# Altium schematic sheet RF_STM.SchDoc
size A4
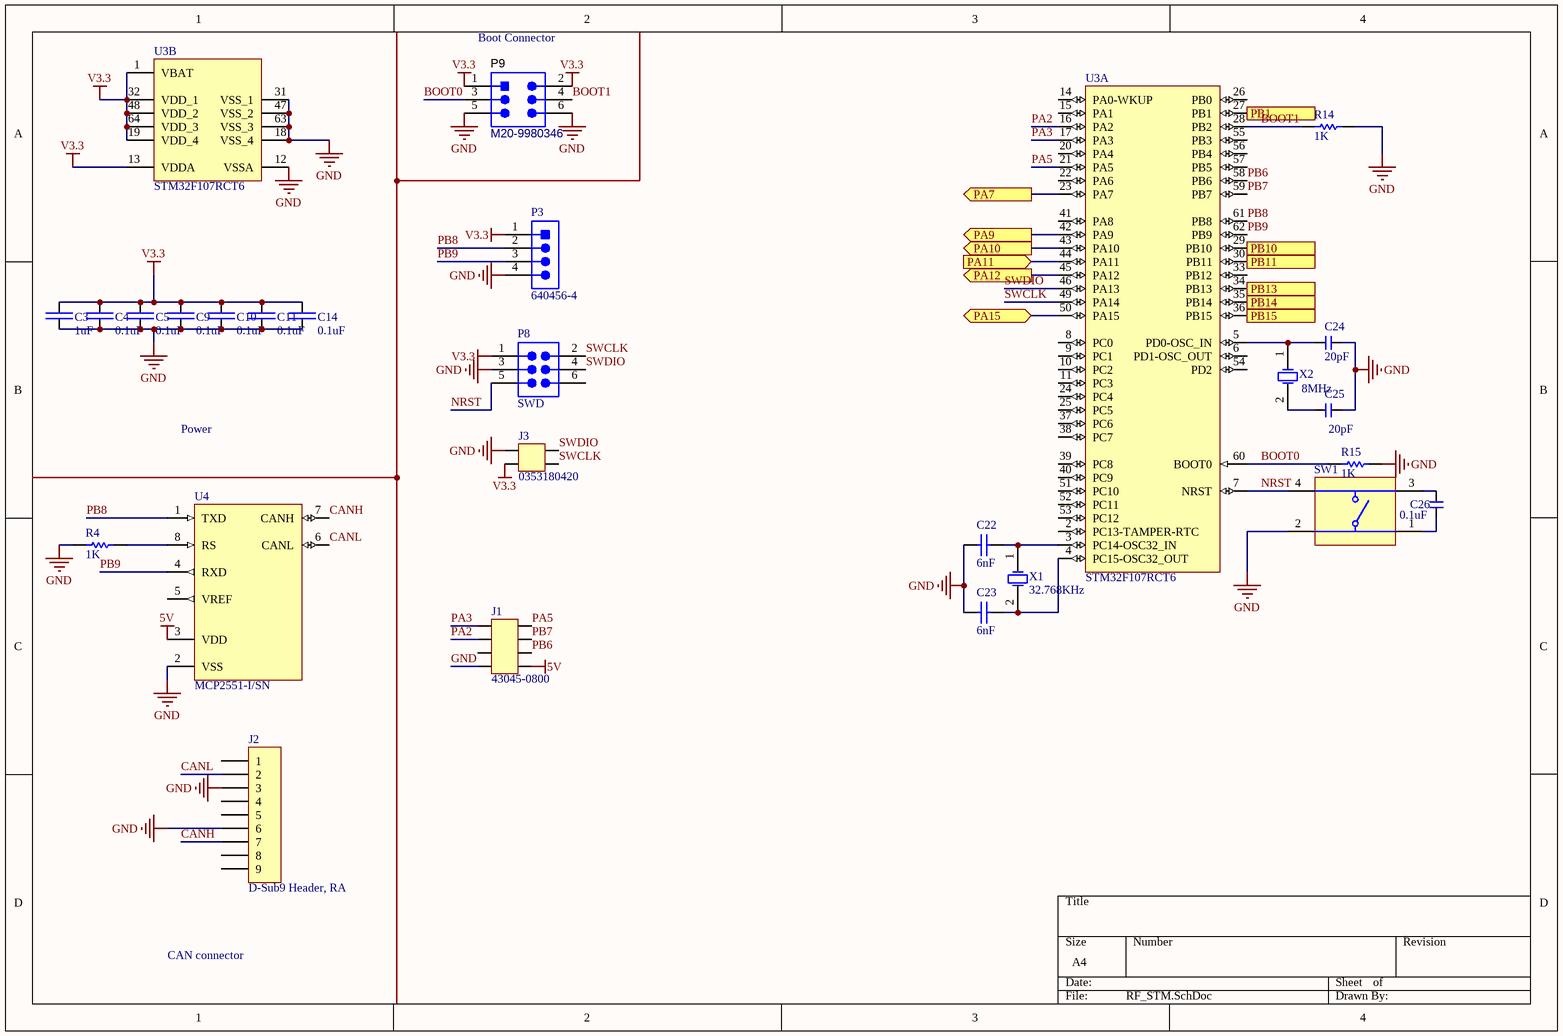
[diagram p0: RF_STM.SchDoc]

## Parts
C3  1uF  [C0805]
C4  0.1uF  [C0805]
C5  0.1uF  [C0805]
C9  0.1uF  [C0805]
C10  0.1uF  [C0805]
C11  0.1uF  [C0805]
C14  0.1uF  [C0805]
C22  6nF  [CAPC2013X140X50LL20T25]
C23  6nF  [CAPC2013X140X50LL20T25]
C24  20pF  [C0805]
C25  20pF  [C0805]
C26  0.1uF  [C0805]
J1  43045-0800  [Micro-Fit 3.0 8pos]
J2  D-Sub9 Header, RA  [D9 Connector]
J3  0353180420  [Mini-fit Jr. 4pos]
P3  640456-4  [TECO-640456-4]
P8  SWD  [SMTC-TSW-103-08-X-D]
P9  M20-9980346  [HRWN-M20-9980346_V]
R4  1K  [RESC1608X55X25ML10T15]
R14  1K  [RESC2013X50X30NL20T20]
R15  1K  [RESC2013X50X30NL20T20]
SW1  PTS645SM43SMTR92LFS  [ITT-PTS645S-4_V]  (value not drawn)
U3  STM32F107RCT6  [STM-LQFP64_M]  (parts A,B of 2)
U4  MCP2551-I/SN  [SOIC-SN8_N]
X1  32.768KHz  [ABRA-ABS07-2_V]
X2  8MHz  [ABRA-ABM3-2_V]

## Ports
PA7 (out), PA9 (out), PA10 (out), PA11 (in), PA12 (out), PA15 (bidir), PB1 (out), PB10 (out), PB11 (in), PB13 (out), PB14 (out), PB15 (out)

## Nets
5V: J1.4 U4.3(VDD)
GND: C3.2 C4.1 C5.1 C9.1 C10.2 C11.1 C14.1 C22.1 C23.1 C24.1 C25.1 J1.8 J2.3 J2.6 J3.1 P3.4 P8.3 P9.5 P9.6 R4.1 R14.1 R15.1 SW1.2 U3.12(VSSA) U3.18(VSS_4) U3.31(VSS_1) U3.47(VSS_2) U3.63(VSS_3) U4.2(VSS)
V3.3: C3.1 C4.2 C5.2 C9.2 C10.1 C11.2 C14.2 J3.3 P3.1 P8.1 P9.1 P9.2 U3.1(VBAT) U3.13(VDDA) U3.19(VDD_4) U3.32(VDD_1) U3.48(VDD_2) U3.64(VDD_3)
BOOT0: P9.3 R15.2 U3.60(BOOT0)
BOOT1: P9.4 R14.2 U3.28(PB2)
CANH: J2.7 U4.7(CANH)
CANL: J2.2 U4.6(CANL)
NRST: P8.5 SW1.4 U3.7(NRST)
PA2: J1.6 U3.16(PA2)
PA3: J1.5 U3.17(PA3)
PA5: J1.1 U3.21(PA5)
PA7: U3.23(PA7) ; port PA7
PA9: U3.42(PA9) ; port PA9
PA10: U3.43(PA10) ; port PA10
PA11: U3.44(PA11) ; port PA11
PA12: U3.45(PA12) ; port PA12
PA15: U3.50(PA15) ; port PA15
PB1: U3.27(PB1) ; port PB1
PB6: J1.3 U3.58(PB6)
PB7: J1.2 U3.59(PB7)
PB8: P3.2 U3.61(PB8) U4.1(TXD)
PB9: P3.3 U3.62(PB9) U4.4(RXD)
PB10: U3.29(PB10) ; port PB10
PB11: U3.30(PB11) ; port PB11
PB13: U3.34(PB13) ; port PB13
PB14: U3.35(PB14) ; port PB14
PB15: U3.36(PB15) ; port PB15
SWCLK: J3.4 P8.2 U3.49(PA14)
SWDIO: J3.2 P8.4 U3.46(PA13)
NetC22_2: C22.2 U3.3(PC14-OSC32_IN) X1.1(X1)
NetC23_2: C23.2 U3.4(PC15-OSC32_OUT) X1.2(X2)
NetC24_2: C24.2 U3.5(PD0-OSC_IN) X2.1(X1)
NetC25_2: C25.2 X2.2(X2)
NetC26_1: C26.1 SW1.3
NetC26_2: C26.2 SW1.1
NetR4_2: R4.2 U4.8(RS)

Not connected (* = marked no-connect by the designer): J1 7; J2 1 4 5 8 9; P8 6; U3 2(PC13-TAMPER-RTC) 6(PD1-OSC_OUT) 8(PC0) 9(PC1) 10(PC2) 11(PC3) 14(PA0-WKUP) 15(PA1) 20(PA4) 22(PA6) 24(PC4) 25(PC5) 26(PB0) 33(PB12) 37(PC6) 38(PC7) 39(PC8) 40(PC9) 41(PA8) 51(PC10) 52(PC11) 53(PC12) 54(PD2) 55(PB3) 56(PB4) 57(PB5); U4 5(VREF)

## Notes on the sheet
- (near P9) Boot Connector
- Power
- CAN connector

## Library data of the parts
C3 = CL21B105KAFNNNE: Cap Ceramic 1uF 25V X7R 10% SMD 0805 125C T/R; Manufacturer: Samsung; Supplier 1: Digi-Key; Supplier Part Number 1: 1276-1066-1-ND; Manufacturer Part Number: CL21B105KAFNNNE; Stock 1: 1606570; Pricing 1: 1 = 0.10000, 10 = 0.07600, 100 = 0.03380, 500 = 0.02416, 1000 = 0.01898 (USD); RoHS: Yes; Mount: Surface Mount; Case/Package: 0805; Contact Plating: Tin; Case Code (Metric): 2012; Case Code (Imperial): 0805; Min Operating Temperature: -55°C; Max Operating Temperature: 125°C; Packaging: Tape and Reel; Package Quantity: 1; Capacitance: 1uF; Tolerance: 10%; Voltage Rating: 25V; Dielectric: X7R; Voltage: 25V; Voltage Rating (DC): 25V; Length: 2mm; Height: 1.25mm; Depth: 1.25mm; Width: 0.049inch; Thickness: 0.053inch; Radiation Hardening: No; Lead Free: Lead Free; ComponentLink1URL: https://datasheet.ciiva.com/25800/cl21b105kafnnne-25800163.pdf?src-supplier=Digi-Key; ComponentLink1Description: https://datasheet.ciiva.com/25800/cl21b105kafnnne-25800163.pdf?src-supplier=Digi-Key; ComponentLink2URL: https://datasheet.ciiva.com/15195/getdatasheetpartid-355205-15195880.pdf?src-supplier=Verical; ComponentLink2Description: https://datasheet.ciiva.com/15195/getdatasheetpartid-355205-15195880.pdf?src-supplier=Verical; Category: Capacitors
C4 C5 C9-C11 C14 C26 = CL21B104KBCWPNC: CAP CER 0.1UF 50V X7R 0805; Manufacturer: Samsung; Capacitance: 100nF; Tolerance: 10%; Supplier 1: Digi-Key; Supplier Part Number 1: 1276-6557-1-ND; Manufacturer Part Number: CL21B104KBCWPNC; Stock 1: 6545; Pricing 1: 1 = 0.10000, 10 = 0.06700, 100 = 0.02990, 500 = 0.02138, 1000 = 0.01680 (USD); RoHS: Yes; Mount: Surface Mount; Case/Package: 0805; Case Code (Metric): 2012; Case Code (Imperial): 0805; Min Operating Temperature: -55°C; Max Operating Temperature: 125°C; Packaging: Tape and Reel; Voltage Rating: 50V; Features: Soft Termination; Length: 0.079inch; Width: 0.049inch; Thickness: 0.053inch; Ratings: AEC-Q200; Category: Capacitors
C22 C23 = CMP-2000-05810-1: Chip Capacitor, 2.2 uF, +/- 10%, 10 V, -55 to 85 degC, 0805 (2012 Metric), RoHS, Tape and Reel; Manufacturer: AVX; Dielectric: X5R; Rated Voltage: 10V; Capacitance: 2.2µF; Tolerance (%): ±10%; Datasheet Version: 05/2016; Manufacturer URL: http://www.avx.com/; Package Description: 2-Pin Surface Mount Device, Body 2.01 x 1.25 mm; Mounting Technology: SurfaceMount; Case Size/Dimension: 0805; Package Reference: 0805; Datasheet URL: http://datasheets.avx.com/cx5r.pdf
C24 C25 = C0805C200J5GACTU: CAP CER 20PF 50V C0G/NP0 0805; Manufacturer: Samsung; Manufacturer Part Number: CL21B103KBANNNC; Material: Ceramic; Capacitance: 10nF; Tolerance: 10%; Dielectric: X7R; Supplier 1: Digi-Key; Supplier Part Number 1: 399-8033-1-ND; RoHS: Yes; Mount: Surface Mount; Case/Package: 0805; Case Code (Metric): 2012; Case Code (Imperial): 0805; Contact Plating: Tin; Min Operating Temperature: -55°C; Max Operating Temperature: 125°C; Packaging: Tape and Reel; Voltage Rating: 50V; Voltage: 50V; Voltage Rating (DC): 50V; Length: 2mm; Height: 0.65mm; Width: 0.049inch; Thickness: 0.03inch; Depth: 1.25mm; Radiation Hardening: No; Lead Free: Lead Free; Category: Capacitors; ComponentLink1Description: https://www.digikey.com/product-detail/en/kemet/C0805C200J5GACTU/399-8033-1-ND/3471756; ComponentLink1URL: https://www.digikey.com/product-detail/en/kemet/C0805C200J5GACTU/399-8033-1-ND/3471756
J1 = 43045-0800: Micro-fit 3.0 8pos right-angle; Manufacturer: Molex; Number of Positions: 8; Contact Resistance: 10mR; Gender: Male; Working Voltage: 250V; Max Voltage Rating (DC): 250.25kV; Current Rating: 5A; Voltage Rating: 600V; Insulation Resistance: 1GR; Pitch: 3mm; Approvals: UL,CSA,TUV; Glow Wire Compliant: Compliant; Supplier 1: Digi-Key; Supplier Part Number 1: WM1816-ND; Manufacturer Part Number: 43045-0800; RoHS: Yes; Category: Headers and Wire Housings; Stock 1: 7880; Mount: Through Hole; Case/Package: SMC; Housing Color: Black; Housing Material: Thermoplastic; Contact Plating: Tin; Contact Material: Brass,Tin; Color: Black; Material: Polyester; Min Operating Temperature: -40°C; Max Operating Temperature: 105°C; Termination: Solder; Number of Contacts: 8; Orientation: Right Angle; Number of Rows: 2; Packaging: Tray; Number of Circuits: 8; Number of Poles: 8; Voltage Rating (AC): 250V; Package Quantity: 1440; Max Current Rating: 5A; Voltage Rating (DC): 250V; Diameter: 3mm; Length: 16.15mm; Height: 8.77mm; Row Spacing: 3mm; Depth: 12.2mm; Radiation Hardening: No; Flammability Rating: UL94 V-0; REACH SVHC: Unknown; Halogen Free: Low Halogen; Lead Free: Lead Free; ComponentLink1URL: https://datasheet.ciiva.com/5158/0430450800-pcb-headers-142625-5158817.pdf?src-supplier=Mouser; ComponentLink1Description: https://datasheet.ciiva.com/5158/0430450800-pcb-headers-142625-5158817.pdf?src-supplier=Mouser; ComponentLink2URL: https://datasheet.ciiva.com/7683/27645-7683683.pdf?src-supplier=Element14; ComponentLink2Description: https://datasheet.ciiva.com/7683/27645-7683683.pdf?src-supplier=Element14; ComponentLink3URL: https://datasheet.ciiva.com/11751/0900766b80027348-11751142.pdf?src-supplier=RSComponents; ComponentLink3Description: https://datasheet.ciiva.com/11751/0900766b80027348-11751142.pdf?src-supplier=RSComponents; ComponentLink4URL: https://datasheet.ciiva.com/30198/267770430450800-pcb-headers-30198875.pdf?src-supplier=Onlinecomponents.com; ComponentLink4Description: https://datasheet.ciiva.com/30198/267770430450800-pcb-headers-30198875.pdf?src-supplier=Onlinecomponents.com; ComponentLink5URL: https://datasheet.ciiva.com/19462/883536-19462164.pdf?src-supplier=Jameco; ComponentLink5Description: https://datasheet.ciiva.com/19462/883536-19462164.pdf?src-supplier=Jameco; ComponentLink6URL: https://datasheet.ciiva.com/14155/04402310-14155206.pdf?src-supplier=Distrelec; ComponentLink6Description: https://datasheet.ciiva.com/14155/04402310-14155206.pdf?src-supplier=Distrelec; ComponentLink7URL: https://datasheet.ciiva.com/16657/0430450800-pcb-headers-16657964.pdf?src-supplier=Avnet+Europe; ComponentLink7Description: https://datasheet.ciiva.com/16657/0430450800-pcb-headers-16657964.pdf?src-supplier=Avnet+Europe; ComponentLink8URL: https://datasheet.ciiva.com/10087/0430450800-pcb-headers-10087853.pdf?src-supplier=Avnet; ComponentLink8Description: https://datasheet.ciiva.com/10087/0430450800-pcb-headers-10087853.pdf?src-supplier=Avnet; ComponentLink9URL: https://datasheet.ciiva.com/1443/1850016-1443537.pdf?src-supplier=Element14; ComponentLink9Description: https://datasheet.ciiva.com/1443/1850016-1443537.pdf?src-supplier=Element14
J2 = 5747840-6: CONN D-SUB PLUG 9POS R/A SOLDER; Manufacturer: TE Connectivity; Body Material: Metal; Body Plating: Tin; Voltage Rating: 125V; Current Rating: 6A; Gender: Male; Number of Positions: 9; Number of Ports: 1; Mating Connector Lock: Yes (With); PCB Mount Retention: With; PCB Mounting Orientation: Right Angle; Preloaded: Yes; Sealable: No (Without); Pitch: 2.74mm; PCB Thickness: 1.57mm; Contact Post Length: 3.17mm; Hole Diameter: 0.125inch; Approvals: CSA,UL; Supplier 1: Digi-Key; Supplier Part Number 1: A32094-ND; Manufacturer Part Number: 5747840-6; Stock 1: 2830; Pricing 1: 1 = 4.13000, 10 = 3.96400, 25 = 3.63360, 50 = 3.46860, 130 = 3.30338, 260 = 2.89046, 520 = 2.80788, 1040 = 2.39496, 2600 = 2.22980 (USD); RoHS: Yes; Mount: Through Hole; Case/Package: Metal; Contact Material: Brass; Contact Plating: Gold,Nickel,Tin; Color: Black; Number of Terminals: 9; Material: Metal; Plating: Tin; Housing Material: Nylon; Contact Shape: Round; Housing Color: Black; Shell Material: Steel; Min Operating Temperature: -55°C; Max Operating Temperature: 105°C; Number of Rows: 2; Packaging: Tray; Package Quantity: 130; Connector Type: Plug; Termination: Solder; Number of Contacts: 9; Orientation: Right Angle; Mating Retention: Yes (With); PCB Mount Alignment: Yes (With); Length: 30.81mm; Height: 12.55mm; Width: 12.55mm; Depth: 18.62mm; Radiation Hardening: No; REACH SVHC: No SVHC; Flammability Rating: UL94 V-0; ComponentLink1URL: https://www.verical.com/server-webapp/html/getDatasheet?partID=46840&src-supplier=Verical; ComponentLink1Description: https://www.verical.com/server-webapp/html/getDatasheet?partID=46840&src-supplier=Verical; ComponentLink2URL: https://www.te.com/commerce/DocumentDelivery/DDEController?Action=srchrtrv&DocNm=82068_AMPLIMITE_Right-Angle_Posted_Conn&DocType=CS&DocLang=English&src-supplier=Digi-Key; ComponentLink2Description: https://www.te.com/commerce/DocumentDelivery/DDEController?Action=srchrtrv&DocNm=82068_AMPLIMITE_Right-Angle_Posted_Conn&DocType=CS&DocLang=English&src-supplier=Digi-Key; ComponentLink3URL: http://www.jameco.com/Jameco/Products/ProdDS/853231.pdf?src-supplier=Jameco; ComponentLink3Description: http://www.jameco.com/Jameco/Products/ProdDS/853231.pdf?src-supplier=Jameco; ComponentLink4URL: http://www.te.com/commerce/DocumentDelivery/DDEController?Action=srchrtrv&DocNm=82068_AMPLIMITE_Right-Angle_Posted_Conn&DocType=Catalog+Section&DocLang=English&src-supplier=Avnet+Europe; ComponentLink4Description: http://www.te.com/commerce/DocumentDelivery/DDEController?Action=srchrtrv&DocNm=82068_AMPLIMITE_Right-Angle_Posted_Conn&DocType=Catalog+Section&DocLang=English&src-supplier=Avnet+Europe; ComponentLink5URL: http://www.te.com/commerce/DocumentDelivery/DDEController?Action=srchrtrv&DocNm=82068_AMPLIMITE_Right-Angle_Posted_Conn&DocType=Catalog+Section&DocLang=English&src-supplier=Avnet; ComponentLink5Description: http://www.te.com/commerce/DocumentDelivery/DDEController?Action=srchrtrv&DocNm=82068_AMPLIMITE_Right-Angle_Posted_Conn&DocType=Catalog+Section&DocLang=English&src-supplier=Avnet; ComponentLink6URL: http://www.te.com/commerce/DocumentDelivery/DDEController?Action=srchrtrv&DocNm=82068_AMPLIMITE_Right-Angle_Posted_Conn&DocType=Catalog+Section&DocLang=English&PartCntxt=&src-supplier=Element14; ComponentLink6Description: http://www.te.com/commerce/DocumentDelivery/DDEController?Action=srchrtrv&DocNm=82068_AMPLIMITE_Right-Angle_Posted_Conn&DocType=Catalog+Section&DocLang=English&PartCntxt=&src-supplier=Element14; Category: Connectors
J3 = 0353180420: Conn Power HDR 4 POS 4.2mm Solder RA Thru-Hole 4 Terminal 1 Port Mini-Fit® Bag; Manufacturer: Molex; Number of Positions: 4; Number of Ports: 1; Connector Type: Male Pin; Row Spacing: 0.165inch; Supplier 1: Digi-Key; Supplier Part Number 1: WM13195-ND; Manufacturer Part Number: 0353180420; RoHS: Yes; Category: Headers and Wire Housings; Stock 1: 17776; Mount: Through Hole; Contact Material: Brass; Contact Plating: Tin; Housing Material: Nylon; Color: Natural; Number of Terminals: 4; Min Operating Temperature: -40°C; Max Operating Temperature: 105°C; Orientation: Right Angle; Number of Rows: 2; Packaging: Bulk; Termination: Solder; Number of Contacts: 4; Package Quantity: 5000; Fastening Type: Ramp; Length: 9.6mm; Pitch: 4.2mm; Contact Mating Length: 0.208inch; Depth: 12.8mm; ComponentLink1URL: https://datasheet.ciiva.com/6840/353180820-sd-6840231.pdf?src-supplier=Digi-Key; ComponentLink1Description: https://datasheet.ciiva.com/6840/353180820-sd-6840231.pdf?src-supplier=Digi-Key
P3 = CMP-2000-05419-1: Male Header, Pitch 2.54 mm, 1 x 4 Position, Height 10.03 mm, Tail Length 3.56 mm, RoHS, Bulk; Manufacturer: TE Connectivity; Material, Housing: Polyester; Primary Type: InterconnectSystem; Mount Angle: Vertical; Color, Housing: White; Current, Rating: 5 / A; Agency Approvals: CSA,UL; Contact Termination Area Plating: Tin; Temperature, Operating: -55to+105 / degC; Standards: RoHSCompliant,ELVCompliant,UL94V-0; Number of Positions: 4; Brand/Series: MTA-100Series; Angle: Straight; Pin Spacing: 0.1 / "; Material, Contact: CopperAlloy; Connector Type: MTA-100; Special Features: Pinstrip; Mounting Hole Size: 0.04 / "; Contact Centerline Spacing: 0.100 / in.; Voltage, Rating: 250 / V; Manufacturer URL: http://www.te.com/; Length, Pin: 0.14 / "; Length, Overall: 0.4 / "; Color: White; Flammability Rating: UL94V-0; Mounting Type: PCMount; Termination: Solder; Datasheet URL: https://datasheet.ciiva.com/16286/eng-ds-82056-mta-0608-16286228.pdf; Number of Contacts: 4; Contact Shape: Square; Contact Mating Area Plating: Tin; Length, Terminal Post: 0.14 / in.; Size, Post: 0.025 / in.; Contact Plating: Tin; Type: PCBPlug; Datasheet Version: Dec-14; Number of Rows: 1
P8 = CMP-1024-00338-1: 0.025" SQ Post Header, Through-hole, Vertical, -55 to 125 degC, 2.54 mm Pitch, 6-Pin, Male, RoHS; Manufacturer: Samtec; PartNumber: TSW-103-08-G-D; Pitch: 2.54 mm; ComponentLink1URL: http://www.samtec.com; ComponentLink2URL: http://www.samtec.com/documents/webfiles/pdf/TSW_TH.PDF; Temperature Range: -55 to 125 degC; RoHS: True; ComponentLink2Description: Datasheet; PackageReference: TSW-103-08-X-D; ComponentLink3Description: Package Specification; PackageDescription: .025[0.64] SQ. Post Terminal Strip Assembly; DatasheetVersion: F-214; Mounting Technology: Through-hole; ComponentLink1Description: Manufacturer URL; Orientation: Vertical; PackageVersion: DM, 8/1988; ComponentLink3URL: http://www.samtec.com/documents/webfiles/cpdf/TSW-XXX-XX-XXX-X-XX-XXX-MKT.pdf
P9 = CMP-2000-06636-1: Male Header, Pitch 2.54 mm, 2 x 3 Position, Height 8.64 mm, Tail Length 3 mm, -40 to 105 degC, RoHS, Bulk; Manufacturer: Harwin-Inc.; Row Spacing: 0.100"(2.54mm); Connector Type: Header,Unshrouded,Breakaway; Number of Positions Loaded: All; Number of Positions: 6; Datasheet Version: 12/2006; Mounting Technology: ThroughHole; Mounting Type: ThroughHole; Fastening Type: -; Contact Finish Thickness: -; Features: -; Series: M20; Package Reference: M20-9980346; Pitch: 0.100"(2.54mm); Contact Mating Length: 0.240"(6.10mm); Manufacturer URL: https://www.harwin.com/; Datasheet URL: https://datasheet.ciiva.com/26899/getdatasheetpartid-483857-26899433.pdf; Number of Rows: 2; Contact Type: MalePin; Termination: Solder; Contact Finish: Tin; Family: RectangularConnectors-Headers,MalePins; Color: Black; Package Description: Male Header, Pitch 2.54 mm, 2 x 3 Position, Height 8.64 mm, Tail Length 3 mm; Packaging: Bulk; Category: Connectors,Interconnects
R4 = CMP-2100-03664-1: Chip Resistor, 10 KOhm, +/- 1%, 01 W, -55 to 155 degC, 0603 (1608 Metric), RoHS, Tape and Reel; Manufacturer: Yageo; Temperature Coefficient: 100ppm/degreesC; Resistance: 10KOhm; Voltage Rating: 75V; Power Rating: 100mW; Voltage Rating (DC): 50V; Composition: ThickFilm; RoHSCompliant: true; Height: 0.45mm; Lead Free: LeadFree; Case Code (Metric): 1608; Case/Package: 0603; Datasheet Version: Rev. 5, 10/2016; Package Reference: 0603; Depth: 0.8mm; Package Description: 2-Pin Surface Mount Device, Body 1.6 x 0.8 mm; Case Code (Imperial): 0603; Packaging: TapeandReel; Termination: SMD/SMT; Lead Pitch: 0.3mm; Width: 0.8mm; Number of Pins: 2; Length: 1.6mm; REACH SVHC: NoSVHC; Military Standard: Not; Max Operating Temperature: 155degC; Min Operating Temperature: -55degC; Manufacturer URL: http://www.yageo.com/; Datasheet URL: http://www.yageo.com/NewPortal/yageodocoutput?fileName=/pdf/R-Chip/PYu-RC_Group_51_RoHS_L_5.pdf; Weight: 7.1E-05oz; Tolerance: 1%
R14 R15 = CMP-2001-03595-1: Part Number: CRCW08051K00FKEA; Manufacturer: Vishay Dale
SW1 = CMP-2000-05160-1: 6 mm Tact Switche, SPST, NO, -20 to 60 degC, 4-Pin SMT, RoHS, Tape and Reel; Manufacturer: ITT Cannon; Manufacturer URL: http://www.ittcannon.com/; Datasheet Version: Feb-14; Datasheet URL: https://datasheet.ciiva.com/29903/getdatasheetpartid-786341-29903846.pdf
U3 = CMP-0237-00079-3: ARM Cortex-M3 32-bit MCU, 256 KB Flash, 64 KB Internal RAM, 51 I/Os, 64-pin LQFP, -40 to 85 degC, Tray; FLASH Size (Prog) (kB): 256; Operating Frequency(F) (Processor speed) (MHz): 72; Supply Voltage(Vcc) min (V): 2; Internal RAM Size (kB): 64; A/D Converter: 2x12-bit (16 Channel); I/Os (High Current): 51; D/A Converter: 2x12-bit (2 Channel); Mounting Technology: Surface Mount; PartNumber: STM32F107RCT6; ComponentLink3URL: http://www.st.com/st-web-ui/static/active/en/resource/technical/document/datasheet/DM00037051.pdf; Packing: Tray; ComponentLink1URL: http://www.st.com/web/en/home.html; Core: ARM Cortex-M3; ComponentLink1Description: Manufacturer URL; ComponentLink2URL: http://www.st.com/st-web-ui/static/active/en/resource/technical/document/datasheet/CD00220364.pdf; DatasheetVersion: Rev. 6; PackageDescription: 64-Pin Low Profile Quad Flat Package, 10 x 10 mm Body, 0.5 mm Pitch; PackageVersion: Rev. 4, 06/2013; ComponentLink2Description: Datasheet; ComponentLink3Description: Package Specification; PackageReference: LQFP64
U4 = CMP-0186-00138-2: High-Speed CAN Transceiver, 8-Pin SOIC, Industrial Temperature; Code_JEDEC: MS-012; ComponentLink3URL: http://www.microchip.com/stellent/groups/techpub_sg/documents/packagingspec/en012702.pdf; DatasheetVersion: revF, Jul-2010; PackageVersion: revBB, Aug-2009; PackageDescription: 8-Lead Plastic Small Outline (SN) - Narrow, 3.90mm Body [SOIC]; ComponentLink1URL: http://www.microchip.com/; ComponentLink3Description: Package Specification; ComponentLink2Description: Datasheet; Code_IPC: SOIC127P600-8; ComponentLink1Description: Manufacturer URL; PackageReference: SOIC-SN8; ComponentLink2URL: http://ww1.microchip.com/downloads/en/DeviceDoc/21667F.pdf; RevisionNote: URLs added. DatasheetVersion updated.
X1 = CMP-0447-00001-2: Crystal, 32.768 kHz, 12.5 pF, -40 to 85 degC, SMD Low Profile 3.2 x 1.5 x 0.9 mm, Tape and Reel; Manufacturer: Abracon; PartNumber: ABS07-32.768KHz-T; Q Value (Type): 30000; Operation Mode: Flexural Mode (Tuning Fork); Shunt Capacitance (C0): 0.9 to 1.2 pF; Load Capacitance (CL): 12.5 pF; Frequency Tolerance @+25degC: +/- 20 ppm; Drive Level (Type): 0.1 uW; Equivalent Series Resistance (R1): 70 Kohm; Insulation Resistance (Min): 500 Mohm; ComponentLink3URL: http://www.abracon.com/Resonators/ABS07.pdf; PackageDescription: 2-Pin Hand Drawn, Body 3.2x1.5mm, Pitch 2.5mm; Operating Temperature: -40 to 85 degC; ComponentLink2URL: http://www.abracon.com/Resonators/ABS07.pdf; PackageReference: ABS07-2; ComponentLink3Description: Package Specification; ComponentLink1Description: Manufacturer URL; DatasheetVersion: 04.03.13; Mounting Technology: Surface Mount; ComponentLink2Description: Datasheet; ComponentLink1URL: http://www.abracon.com/; Packing: Tape and Reel; Frequency: 32.768 kHz
X2 = CMP-2000-05033-1: Miniature Ceramic Crystal, 8 MHz, -40 to 85 degC, 2-Pin SMD, RoHS, Tape and Reel; Manufacturer: ABRACON; Case Length: 5mm; Case Width: 3.2mm; Case Height: 1.3mm; Load Capacitance: 18pF; Frequency Stability: 30PPM; ESR: 140Ohms; Tolerance: 20PPM; Type: MiniatureCeramicCrystal; Factory Pack Quantity: 1000; Package / Case: 5mmx3.2mm; Mounting Style: SMD/SMT; Manufacturer URL: http://www.abracon.com/; RoHS: Details; Frequency: 8MHz; Dimensions: 3.2mmWx5mmLx1.3mmH; Datasheet URL: http://www.farnell.com/datasheets/1754353.pdf; Brand: ABRACON; Packaging: Reel; Product Category: Crystals; Package Description: 2-Pin Surface Mount Device, Body 5 x 3.2 mm; Package URL: http://www.abracon.com/Support/PackageDrawing/Resonators/ABM3.PDF; Operating Temperature Range: -40Cto+85C; Termination Style: SMD/SMT; Datasheet Version: Sep-13; Series: ABM3; Package Reference: ABM3-2